# EAGLE design business card (EAGLE 9.2.2)
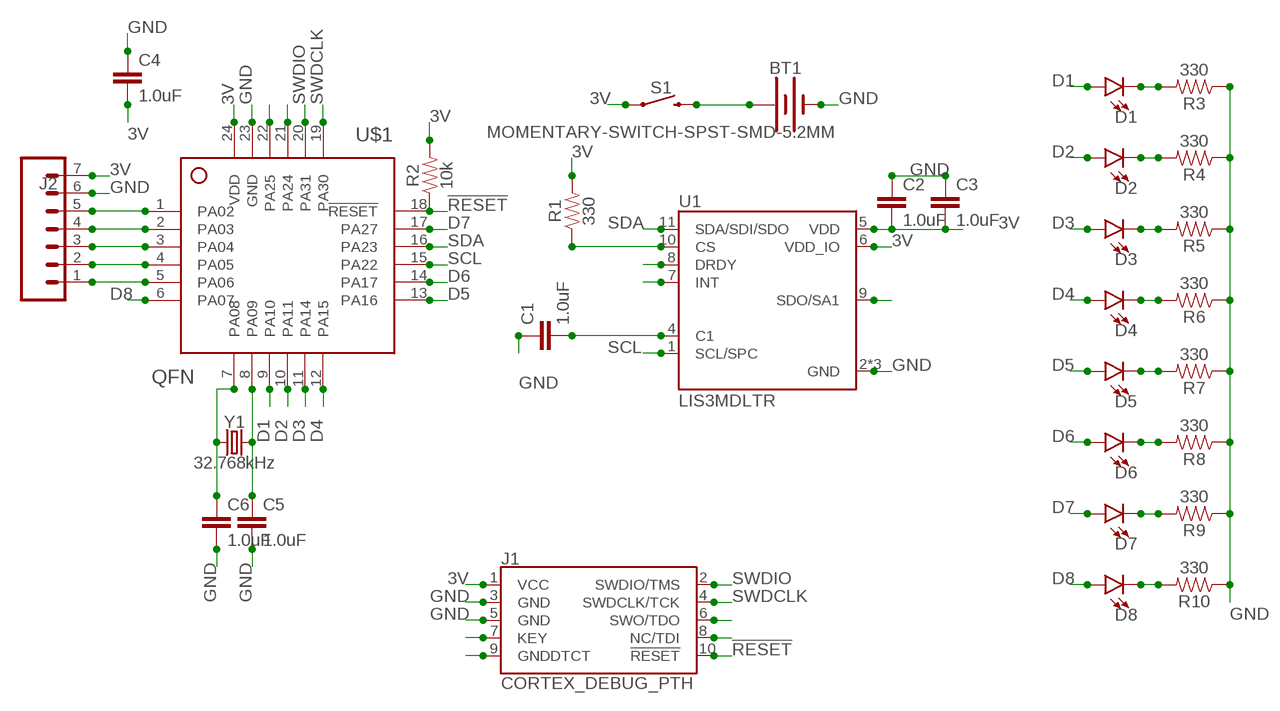
[diagram p0: schematic, sheet 1]

## Parts
BT1  BATTERY-20MM_SMD_4LEGS  [BATTCON_20MM_4LEGS]
C1  1.0uF  1.0UF-0402-16V-10%  [0402]
C2  1.0uF  1.0UF-0402-16V-10%  [0402]
C3  1.0uF  1.0UF-0402-16V-10%  [0402]
C4  1.0uF  1.0UF-0402-16V-10%  [0402]
C5  1.0uF  1.0UF-0402-16V-10%  [0402]
C6  1.0uF  1.0UF-0402-16V-10%  [0402]
D1  LED0603  [LED-0603]
D2  LED0603  [LED-0603]
D3  LED0603  [LED-0603]
D4  LED0603  [LED-0603]
D5  LED0603  [LED-0603]
D6  LED0603  [LED-0603]
D7  LED0603  [LED-0603]
D8  LED0603  [LED-0603]
J1  CORTEX_DEBUG_PTH  [2X5-PTH-1.27MM]
J2  CONN_07  [1X07]
R1  330  330OHM-0603-1/10W-1%  [0603]
R2  10k  330OHM-0603-1/10W-1%  [0603]
R3  330  330OHM-0603-1/10W-1%  [0603]
R4  330  330OHM-0603-1/10W-1%  [0603]
R5  330  330OHM-0603-1/10W-1%  [0603]
R6  330  330OHM-0603-1/10W-1%  [0603]
R7  330  330OHM-0603-1/10W-1%  [0603]
R8  330  330OHM-0603-1/10W-1%  [0603]
R9  330  330OHM-0603-1/10W-1%  [0603]
R10  330  330OHM-0603-1/10W-1%  [0603]
S1  MOMENTARY-SWITCH-SPST-SMD-5.2MM  [TACTILE_SWITCH_SMD_5.2MM]
U1  LIS3MDLTR  [LGA12R50P4X4_200X200X100]
U$1  QFN  [QFN24-4X4]
Y1  32.768kHz  CRYSTAL-32.768KHZSMD-3.2X1.5  [CRYSTAL-SMD-3.2X1.5MM]

## Nets
3V: C2.2 C3.2 C4.2 J1.1(VCC) J2.7 R1.2 R2.2 S1.1 U1.5(VDD) U1.6(VDD_IO) U$1.24(VDD)
!RESET: J1.10(!RESET) R2.1 U$1.18(!RESET)
D1: D1.A U$1.9(PA10)
D2: D2.A U$1.10(PA11)
D3: D3.A U$1.11(PA14)
D4: D4.A U$1.12(PA15)
D5: D5.A U$1.13(PA16)
D6: D6.A U$1.14(PA17)
D7: D7.A U$1.17(PA27)
D8: D8.A U$1.6(PA07)
GND: BT1.NEGATIVE(-) C1.1 C2.1 C3.1 C4.1 C5.2 C6.2 J1.3(GND) J1.5(GND) J2.6 R3.1 R4.1 R5.1 R6.1 R7.1 R8.1 R9.1 R10.1 U1.2(GND) U1.3(GND) U1.12(GND) U$1.23(GND)
N$1: D1.C R3.2
N$2: C6.1 U$1.7(PA08) Y1.P$1
N$3: C5.1 U$1.8(PA09) Y1.P$2
N$4: J1.9(GNDDTCT)
N$5: BT1.POSITIVE@1(+) BT1.POSITIVE@2(+) BT1.POSITIVE@3(+) BT1.POSITIVE@4(+) S1.3
N$7: J1.8(NC/TDI)
N$9: J1.7(KEY)
N$10: J1.6(SWO/TDO)
N$12: C1.2 U1.4(C1)
N$13: U1.7(INT)
N$14: U1.8(DRDY)
N$15: R1.1 U1.10(CS)
N$19: U1.9(SDO/SA1)
N$21: J2.5 U$1.1(PA02)
N$22: J2.4 U$1.2(PA03)
N$23: J2.3 U$1.3(PA04)
N$24: J2.2 U$1.4(PA05)
N$25: J2.1 U$1.5(PA06)
N$41: U$1.21(PA24)
N$42: U$1.22(PA25)
N$54: D2.C R4.2
N$55: D3.C R5.2
N$56: D4.C R6.2
N$57: D5.C R7.2
N$58: D6.C R8.2
N$59: D7.C R9.2
N$60: D8.C R10.2
SCL: U1.1(SCL/SPC) U$1.15(PA22)
SDA: U1.11(SDA/SDI/SDO) U$1.16(PA23)
SWDCLK: J1.4(SWDCLK/TCK) U$1.19(PA30)
SWDIO: J1.2(SWDIO/TMS) U$1.20(PA31)

## Library data of the parts
BT1 = SparkFun-Batteries:BATTERY: Battery - Single Cell A variety of battery chemistries, sizes, and footprints. Device List: 20MM_PTH - Coin Cell Battery Holder - 20mm (PTH) <https://www.sparkfun.com/products/783> 6.8MM_PTH - Coin Cell Battery Holder - 6.8MM(SMD) <https://www.digikey.com/product-detail/en/seiko-instruments/MS621FE-FL11E/728-1057-ND/1889208?WT.srch=1&gclid=CNOQ5a6LzdQCFZS2wAodXCkE0g> 12MM_SMD - Coin Cell Battery Holder - 12mm (SMD) <https://www.sparkfun.com/products/10592> 12MM_PTH - Coin Cell Battery Holder - 12mm (PTH) <https://www.sparkfun.com/products/7948> 20MM_SMD - 20mm Coin Cell Battery Holder (SMD) (2 legs) Used on the Big Time Watch Kit <https://www.sparkfun.com/products/11734> 20MM_SMD_4LEGS - Coin Cell Battery Holder - 20mm (SMD) <https://www.sparkfun.com/products/11892> 20MM_SMD_4LEGS_OVERPASTE - Coin Cell Battery Holder - 20mm (SMD) <https://www.sparkfun.com/products/11892> (Over-paste on the legs) 24.5MM_PTH - Coin Cell Battery Holder - 24.5mm (PTH) <https://www.sparkfun.com/products/8863> 9V - 9V Battery Holder - PC Mount Used on the SparkFun SparkPunk Sound Kit <https://www.sparkfun.com/products/11177> and SparkFun SparkPunk Sequencer Kit <https://www.sparkfun.com/products/12707> 18650 - Battery Holder - 18650 (PTH) <https://www.sparkfun.com/products/13113> AA - Battery Holder - 1xAA (PTH) <https://www.sparkfun.com/products/7949> AAA - Battery Holder - 1xAAA (PTH) <https://www.sparkfun.com/products/12718> AA_KIT - Battery Holder - 1xAA (PTH) <https://www.sparkfun.com/products/7949> Special kit package - pads only have exposed copper on one side of the board. AAA_KIT - Battery Holder - 1xAAA (PTH) <https://www.sparkfun.com/products/12718> Special kit package - pads only have exposed copper on one side of the board.; PROD_ID: BATT-10373; SF_SKU: PRT-11892
C1-C6 = SparkFun-Capacitors:1.0UF: 1µF ceramic capacitors A capacitor is a passive two-terminal electrical component used to store electrical energy temporarily in an electric field.; PROD_ID: CAP-12417
D1-D8 = SparkFun-LED:LED: LED (Generic) Standard schematic elements and footprints for 5mm, 3mm, 1206, and 0603 sized LEDs. Generic LEDs with no color specified.
J1 = SparkFun-Connectors:CORTEX_DEBUG: Cortex Debug Connector - 10 pin Supports JTAG debug, Serial Wire debug, and Serial Wire Viewer. PTH and SMD connector options available. General Connector Information <http://infocenter.arm.com/help/topic/com.arm.doc.faqs/attached/13634/cortex_debug_connectors.pdf> Products: PTH Connector <http://www.digikey.com/product-detail/en/cnc-tech/3220-10-0100-00/1175-1627-ND/3883661> -via Digi-Key SparkFun PSoc <https://www.sparkfun.com/products/13229> SparkFun T <https://www.sparkfun.com/products/13810>
J2 = SparkFun-Connectors:CONN_07: Multi connection point. Often used as Generic Header-pin footprint for 0.1 inch spaced/style header connections On any of the 0.1 inch spaced packages, you can populate with these: Break Away Headers - Straight <https://www.sparkfun.com/products/116> (PRT-00116) Break Away Male Headers - Right Angle <https://www.sparkfun.com/products/553> (PRT-00553) Female Headers <https://www.sparkfun.com/products/115> (PRT-00115) Break Away Headers - Machine Pin <https://www.sparkfun.com/products/117> (PRT-00117) Break Away Female Headers - Swiss Machine Pin <https://www.sparkfun.com/products/743> (PRT-00743) For SCREWTERMINALS and SPRING TERMINALS visit here: Screw Terimnals on SparkFun.com <https://www.sparkfun.com/search/results?term=Screw+Terminals> (5mm/3.5mm/2.54mm spacing) This device is also useful as a general connection point to wire up your design to another part of your project. Our various solder wires solder well into these plated through hole pads. Hook-Up Wire - Assortment (Stranded, 22 AWG) <https://www.sparkfun.com/products/11375> (PRT-11375) Hook-Up Wire - Assortment (Solid Core, 22 AWG) <https://www.sparkfun.com/products/11367> (PRT-11367) View the entire wire category on our website here <https://www.sparkfun.com/categories/141> Special notes: Molex polarized connector foot print use with SKU : PRT-08231 with associated crimp pins and housings. 1MM SMD Version SKU: PRT-10208 NOTES ON THE VARIANTS LOCK and LOCK_LONGPADS... This footprint was designed to help hold the alignment of a through-hole component (i.e. 6-pin header) while soldering it into place. You may notice that each hole has been shifted either up or down by 0.005 of an inch from it's more standard position (which is a perfectly straight line). This slight alteration caused the pins (the squares in the middle) to touch the edges of the holes. Because they are alternating, it causes a "brace" to hold the component in place. 0.005 has proven to be the perfect amount of "off-center" position when using our standard breakaway headers. Although looks a little odd when you look at the bare footprint, once you have a header in there, the alteration is very hard to notice. Also,if you push a header all the way into place, it is covered up entirely on the bottom side.
R1 R3-R10 = SparkFun-Resistors:330OHM: 330Ω resistor A resistor is a passive two-terminal electrical component that implements electrical resistance as a circuit element. Resistors act to reduce current flow, and, at the same time, act to lower voltage levels within circuits. - Wikipedia; PROD_ID: RES-00818
R2 = SparkFun-Resistors:330OHM: 330Ω resistor A resistor is a passive two-terminal electrical component that implements electrical resistance as a circuit element. Resistors act to reduce current flow, and, at the same time, act to lower voltage levels within circuits. - Wikipedia; PROD_ID: RES-00818; VALUE: 330
S1 = SparkFun-Switches:MOMENTARY-SWITCH-SPST: Momentary Switch (Pushbutton) - SPST Normally-open (NO) SPST momentary switches (buttons, pushbuttons). Variants PTH-12MM - 12mm square, through-hole Momentary Pushbutton Switch - 12mm Square <https://www.sparkfun.com/products/9190> (COM-09190) PTH-6.0MM, PTH-6.0MM-KIT - 6.0mm square, through-hole Mini Pushbutton Switch <https://www.sparkfun.com/products/97> (COM-00097) KIT package intended for soldering kit's - only one side of pads' copper is exposed. PTH-RIGHT-ANGLE-KIT - Right-angle, through-hole Right Angle Tactile Button <https://www.sparkfun.com/products/10791> - Used on SparkFun BigTime Watch Kit <https://www.sparkfun.com/products/11734> SMD-12MM - 12mm square, surface-mount Tactile Button - SMD (12mm) <https://www.sparkfun.com/products/12993> (COM-12993) Used on SparkFun PicoBoard <https://www.sparkfun.com/products/11888> SMD-4.5MM - 4.5mm Square Trackball Switch Used on SparkFun Blackberry Trackballer Breakout <https://www.sparkfun.com/products/13169> SMD-4.6MMX2.8MM - 4.60mm x 2.80mm, surface mount Used on SparkFun SAMD21 Mini Breakout <https://www.sparkfun.com/products/13664> SMD-5.2MM, SMD-5.2-REDUNDANT - 5.2mm square, surface-mount Mini Pushbutton Switch - SMD <https://www.sparkfun.com/products/8720> (COM-08720) Used on Arduino Pro Mini <https://www.sparkfun.com/products/11114> REDUNDANT package connects both switch circuits together SMD-6.0X3.5MM - 6.0 x 3.5mm, surface mount Momentary Reset Switch SMD <https://www.sparkfun.com/products/8229> (COM-08229) SMD-6.2MM-TALL - 6.2mm square, surface mount Tactile Button - SMD (6mm) <https://www.sparkfun.com/products/12992> Used on SparkFun Digital Sandbox <https://www.sparkfun.com/products/12651> SMD-RIGHT-ANGLE - Right-angle, surface mount Used on SparkFun Block for Intel® Edison - Arduino <https://www.sparkfun.com/products/13036>; PROD_ID: SWCH-08247; SF_SKU: COM-08720
U1 = LIS3MDLTR:LIS3MDLTR: LIS3MDL Series 3 Axis ±2/±8/±12/±16 g 3.6V High Performance Magnetometer LGA-12; AVAILABILITY: Unavailable; DESCRIPTION: LIS3MDL Series 3 Axis ±2/±8/±12/±16 g 3.6V High Performance Magnetometer LGA-12; MF: STMicroelectronics; MP: LIS3MDLTR; PACKAGE: VFLGA-12 STMicroelectronics; PRICE: None
U$1 = SAMD11C14:QFN
Y1 = SparkFun-Clocks:CRYSTAL-32.768KHZ: 32.768kHz Crystal Frequency: 32.768kHz Frequency Stability: ±20ppm Load Capacitance: 12.5pF (PTH-2X6 & SMD-3.2X1.5), 6pF (SMD-2X6) SparkFun Products: SparkFun BigTime Watch Kit <https://www.sparkfun.com/products/11734> SparkFun nRF52832 Breakout <https://www.sparkfun.com/products/13990> SparkFun Real Time Clock Module <https://www.sparkfun.com/products/12708>; PROD_ID: XTAL-13062

## Board
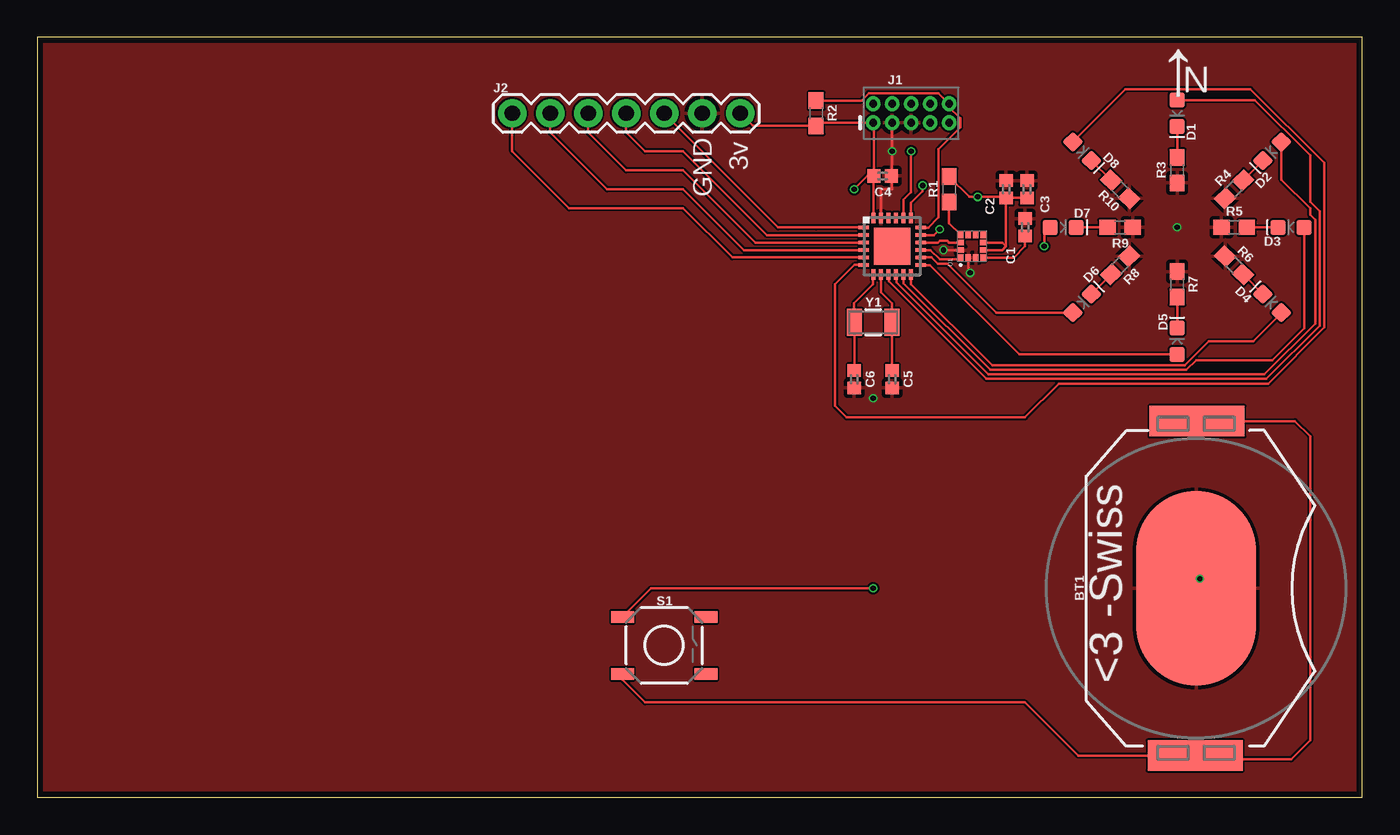
[diagram p1: board, top side]
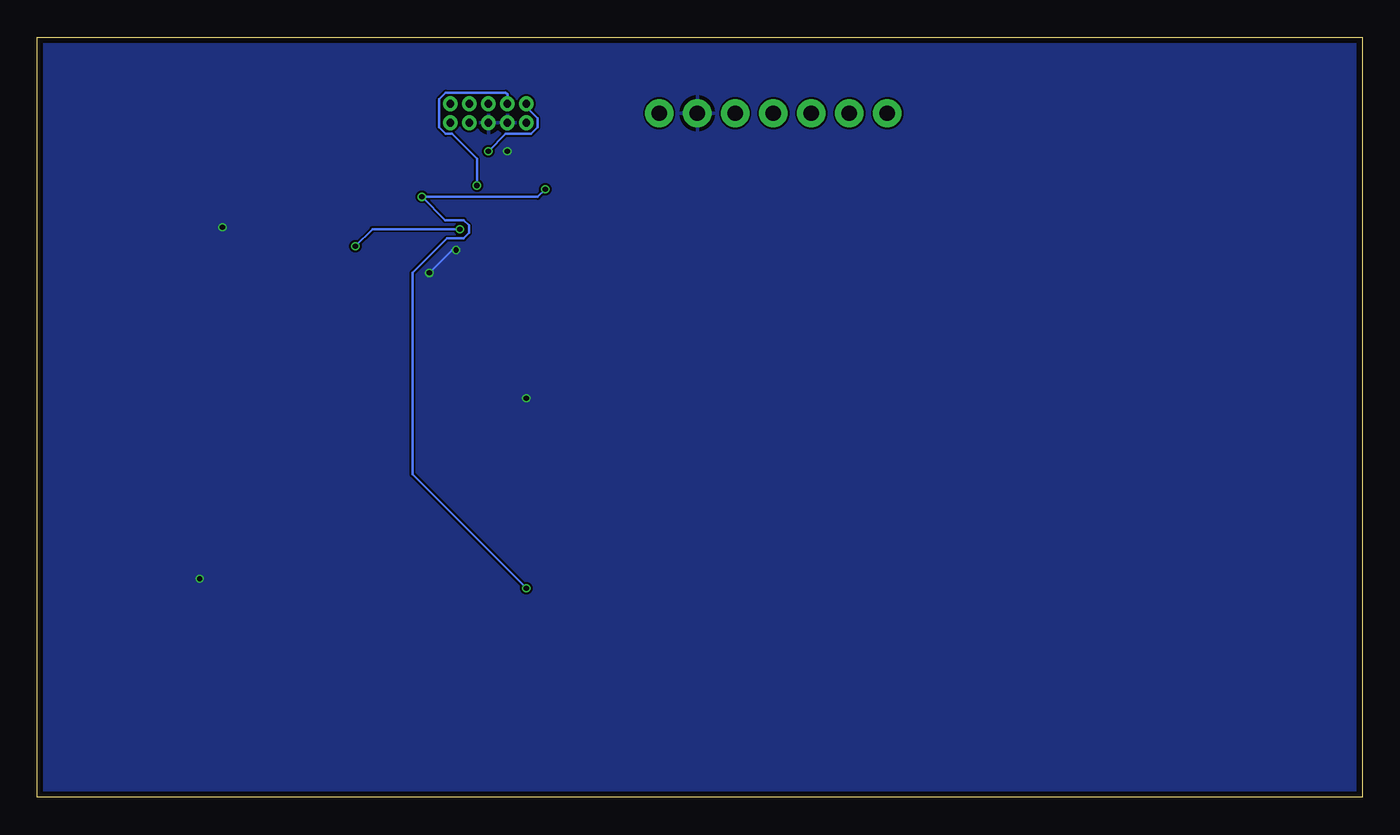
[diagram p2: board, bottom side, seen from below]

Size 88.57 x 50.79 mm. Coordinates in mm from the lower left corner, seen from the top.
Outline: 0,0 88.57,0 88.57,50.79 0,50.79 0,0
Copper layers (1*16): Top 0.035mm / dielectric 1.5mm / Bottom 0.035mm
Design rules "MF_Standard_2_Layer *": minimum track width 5mil, minimum drill 10mil, track to track 5mil, track to pad 5mil, pad to pad 5mil, via to via 5mil, smd to smd 0mil, copper to edge 15mil, drill to drill 10mil, minimum pad ring 4mil, minimum via ring 4mil, stop-mask expansion 2mil, vias tented up to drill 25mil, thermal gap 10mil

### Footprints (pad centres in the part's own frame; a part is rotated, then mirrored left to right if it is on the bottom)
BATTCON_20MM_4LEGS = smd 13 x 8: NEGATIVE 0,0 | smd 2.032 x 3.175: POSITIVE@1 -11.176,1.651; POSITIVE@2 -11.176,-1.524; POSITIVE@3 11.176,1.524; POSITIVE@4 11.176,-1.651
0402 = smd 0.85 x 0.9: 1 -0.58,0; 2 0.58,0
LED-0603 = smd 1 x 1: A -0.877,0; C 0.877,0
2X5-PTH-1.27MM = drill 0.508 pad 1: 1 -2.54,-0.635; 2 -2.54,0.635; 3 -1.27,-0.635; 4 -1.27,0.635; 5 0,-0.635; 6 0,0.635; 7 1.27,-0.635; 8 1.27,0.635; 9 2.54,-0.635; 10 2.54,0.635
1X07 = drill 1.016 pad 1.88: 1 0,0; 2 2.54,0; 3 5.08,0; 4 7.62,0; 5 10.16,0; 6 12.7,0; 7 15.24,0
0603 = smd 1.1 x 1: 1 -0.85,0; 2 0.85,0
TACTILE_SWITCH_SMD_5.2MM = smd 1.524 x 0.762: 1 -2.794,1.905; 2 2.794,1.905; 3 -2.794,-1.905; 4 2.794,-1.905
LGA12R50P4X4_200X200X100 = smd 0.45 x 0.35: 1 -0.76,0.75; 2 -0.76,0.25; 3 -0.76,-0.25; 4 -0.76,-0.75; 7 0.76,-0.75; 8 0.76,-0.25; 9 0.76,0.25; 10 0.76,0.75 | smd 0.35 x 0.45: 5 -0.25,-0.76; 6 0.25,-0.76; 11 0.25,0.76; 12 -0.25,0.76
QFN24-4X4 = smd 0.7 x 0.25: 1 -1.9,1.25; 2 -1.9,0.75; 3 -1.9,0.25; 4 -1.9,-0.25; 5 -1.9,-0.75; 6 -1.9,-1.25; 13 1.9,-1.25; 14 1.9,-0.75; 15 1.9,-0.25; 16 1.9,0.25; 17 1.9,0.75; 18 1.9,1.25 | smd 0.25 x 0.7: 7 -1.25,-1.9; 8 -0.75,-1.9; 9 -0.25,-1.9; 10 0.25,-1.9; 11 0.75,-1.9; 12 1.25,-1.9; 19 1.25,1.9; 20 0.75,1.9; 21 0.25,1.9; 22 -0.25,1.9; 23 -0.75,1.9; 24 -1.25,1.9 | smd 2.45 x 2.45: EXP 0,0
CRYSTAL-SMD-3.2X1.5MM = smd 1 x 1.8: P$1 -1.25,0; P$2 1.25,0

### Placement (x,y rotation side)
BT1  77.47,13.97 90 top
C1  66.04,38.1 270 top
C2  64.77,40.64 270 top
C3  66.17,40.64 270 top
C4  56.52,41.53 180 top
C5  57.15,27.94 270 top
C6  54.61,27.94 270 top
D1  76.2,45.72 270 top
D2  82.55,43.18 225 top
D3  83.82,38.1 180 top
D4  82.55,33.02 135 top
D5  76.2,30.48 90 top
D6  69.85,33.02 45 top
D7  68.58,38.1 0 top
D8  69.85,43.18 315 top
J1  58.42,45.72 0 top
J2  31.75,45.72 0 top
R1  60.96,40.64 90 top
R2  52.07,45.72 270 top
R3  76.2,41.91 90 top
R4  80.01,40.64 45 top
R5  80.01,38.1 0 top
R6  80.01,35.56 315 top
R7  76.2,34.29 270 top
R8  72.39,35.56 225 top
R9  72.39,38.1 180 top
R10  72.39,40.64 135 top
S1  41.91,10.16 0 top
U1  62.48,36.83 90 top
U$1  57.15,36.83 0 top
Y1  55.88,31.75 0 top

### Tracks (layer width: path | path; a pad name or v marks a point on that pad's centre or on a via)
3V  (via drill 0.35)
  Top 0.152: U1.5 64.52,36.58 64.77,36.83 | 64.77,36.83 C2.2 | U1.6 64.52,37.08 64.77,36.83 | U$1.24 55.9,41.49 C4.2 | C4.2 55.94,45.03 J1.1 52.28,45.09 R2.2 47.84,44.87 J2.7 | C4.2 55.5,41.53 v54.61,40.64 | R1.2 62.32,40.13 v62.87,40.13 64.7,40.13 C2.2 | C2.2 C3.2 | S1.1 41.02,13.97 v55.88,13.97
  Bottom 0.152: v54.61,40.64 55.12,40.13 v62.87,40.13 61.31,38.58 60.07,38.58 59.72,38.22 59.72,37.72 60.07,37.37 61.18,37.37 63.5,35.05 63.5,21.59 v55.88,13.97
!RESET
  Top 0.152: U$1.18 59.56,38.08 60.23,38.75 60.23,43.31 61.7,44.78 61.7,45.39 60.96,46.13 J1.10 60.26,47.06 55.59,47.06 55.1,46.57 R2.1
D1
  Top 0.152: U$1.9 56.92,34.91 56.92,34.5 63.46,27.96 82.16,27.96 85.73,31.53 85.73,39.16 85.09,39.8 85.09,42.91 81.4,46.6 D1.A
D2
  Top 0.152: U$1.10 57.42,34.91 57.42,34.43 63.58,28.27 82.04,28.27 85.43,31.66 85.43,38.61 85.09,38.94 85.09,39.37 83.17,41.29 D2.A
D3
  Top 0.152: U$1.11 57.92,34.91 57.92,34.36 63.71,28.57 76.83,28.57 77.47,29.21 82.55,29.21 84.7,31.36 D3.A
D4
  Top 0.152: U$1.12 58.42,34.91 58.42,34.29 63.84,28.87 76.71,28.87 78.31,30.48 81.28,30.48 83.17,32.37 D4.A
D5
  Top 0.152: U$1.13 59.07,35.56 59.69,35.56 65.65,29.6 D5.A
D6
  Top 0.152: U$1.14 59.79,36.08 60.2,35.66 60.86,35.66 64.12,32.4 D6.A
D7  (via drill 0.35)
  Top 0.152: U$1.17 59.93,37.58 v60.33,37.97 | v67.31,36.83 67.31,37.71 D7.A
  Bottom 0.152: v60.33,37.97 66.17,37.97 v67.31,36.83
D8
  Top 0.152: D8.A 72.75,47.33 81.11,47.33 86.03,42.4 86.03,31.4 82.29,27.66 68.3,27.66 66.04,25.4 54.1,25.4 53.34,26.16 53.34,34.29 54.63,35.58 U$1.6
GND  (via drill 0.35)
  Top 0.152: U$1.23 56.4,40.64 57.15,40.64 v57.15,43.18 J1.3 | v60.58,36.58 U1.12 | U1.2 62.23,35.17 v62.36,35.05
  Bottom 0.152: v62.36,35.05 60.83,36.58 v60.58,36.58
  other vias: 55.88,26.67 77.72,14.61 76.2,38.1
  pour Top: 0,50.8 88.9,50.8 88.9,0 0,0
  pour Bottom: 0,50.8 88.9,50.8 88.9,0 0,0
N$1
  Top 0.152: D1.C R3.2
N$2
  Top 0.152: U$1.7 55.88,34.91 55.88,34.29 54.61,33.02 54.61,31.77 Y1.P$1 54.63,28.54 C6.1
N$3
  Top 0.152: U$1.8 56.4,33.77 57.15,33.02 57.15,31.77 Y1.P$2 57.13,28.54 C5.1
N$5
  Top 0.152: S1.3 39.12,7.87 40.64,6.35 66.04,6.35 69.6,2.79 BT1.POSITIVE@1 BT1.POSITIVE@2 79.25,2.54 83.82,2.54 85.09,3.81 85.09,24.13 84.07,25.15 BT1.POSITIVE@4 BT1.POSITIVE@3
N$12
  Top 0.152: U1.4 65.28,36.07 66.04,36.83 C1.2
N$15
  Top 0.152: U1.10 60.96,38.36 R1.1
N$21
  Top 0.152: U$1.1 55.23,38.1 52.07,38.1 49.53,38.1 J2.5
N$22
  Top 0.152: U$1.2 48.78,37.58 43.18,43.18 40.64,43.18 39.37,44.45 J2.4
N$23
  Top 0.152: U$1.3 48.01,37.08 43.18,41.91 39.37,41.91 36.83,44.45 J2.3
N$24
  Top 0.152: U$1.4 47.24,36.58 43.18,40.64 38.1,40.64 34.29,44.45 J2.2
N$25
  Top 0.152: U$1.5 46.47,36.08 43.18,39.37 35.56,39.37 31.75,43.18 J2.1
N$54
  Top 0.152: R4.2 D2.C
N$55
  Top 0.152: R5.2 D3.C
N$56
  Top 0.152: R6.2 D4.C
N$57
  Top 0.152: R7.2 D5.C
N$58
  Top 0.152: R8.2 D6.C
N$59
  Top 0.152: R9.2 D7.C
N$60
  Top 0.152: R10.2 D8.C
SCL
  Top 0.152: U$1.15 59.72,36.58 60.33,35.97 61.63,35.97 U1.1
SDA
  Top 0.152: U$1.16 60.23,37.08 60.33,37.18 60.83,37.18 60.93,37.08 U1.11
SWDCLK  (via drill 0.35)
  Top 0.152: U$1.19 58.4,39.73 59.18,40.51 v59.18,40.89
  Bottom 0.152: v59.18,40.89 59.18,42.67 60.86,44.35 61.27,44.35 61.7,44.78 61.7,46.66 61.27,47.09 57.25,47.09 57.15,46.99 J1.4
SWDIO  (via drill 0.35)
  Top 0.152: U$1.20 57.92,38.75 57.92,39.94 58.42,40.44 v58.42,43.18
  Bottom 0.152: v58.42,43.18 57.25,44.35 55.58,44.35 55.14,44.78 55.14,45.39 55.88,46.13 J1.2

### Text on the board
tNames: ↑ | N | 3v | GND | <3 -Swiss
tValues: Hold Down To Use
tStop: Michael Bales | CEO | Santa Barbara Hackerspace, Inc. | 5782 Thornwood Drive | Goleta, CA 93117 | (805) 242-2533 | mbales@sbhackerspace.com